# EAGLE design usb sniffer (EAGLE 6.5.0)
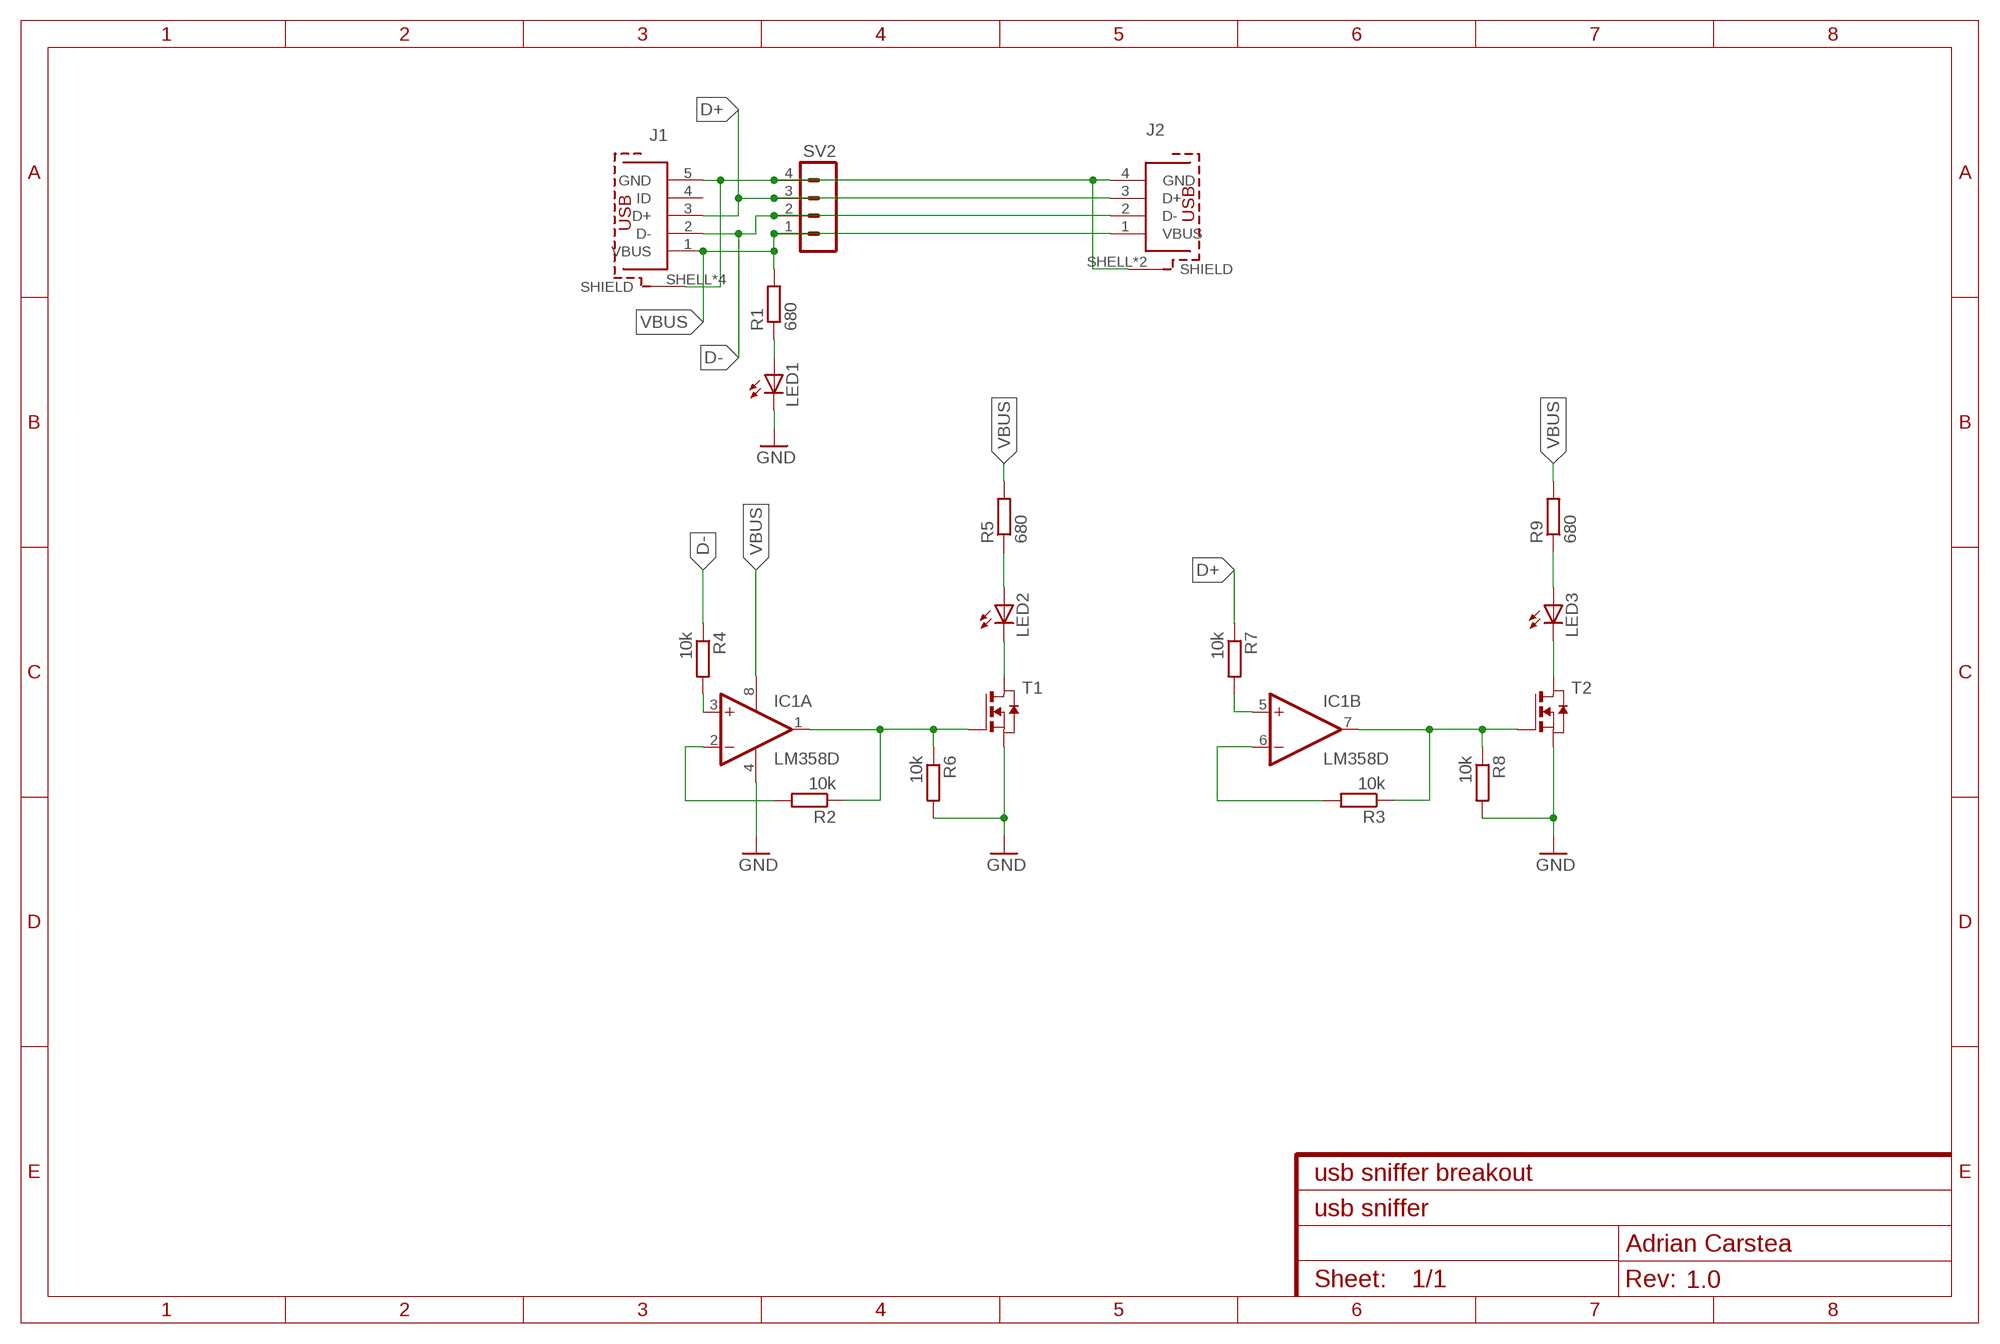
[diagram p0: schematic, sheet 1]
FRAME1 (FRAME-A4L): CNAME: usb sniffer breakout; CREVISION: 1.0; DESIGNER: Adrian Carstea

## Parts
IC1  LM358D  [SO08]
J1  629105136821  [629105136821]
J2  61400416021  [61400416021]
LED1  LEDSML0805  [SML0805]
LED2  LEDSML0805  [SML0805]
LED3  LEDSML0805  [SML0805]
R1  680  R-EU_R0805  [R0805]
R2  10k  R-EU_R0805  [R0805]
R3  10k  R-EU_R0805  [R0805]
R4  10k  R-EU_R0805  [R0805]
R5  680  R-EU_R0805  [R0805]
R6  10k  R-EU_R0805  [R0805]
R7  10k  R-EU_R0805  [R0805]
R8  10k  R-EU_R0805  [R0805]
R9  680  R-EU_R0805  [R0805]
SV2  MA04-1  [MA04-1]
T1  NMOSSOT23  [SOT-23]
T2  NMOSSOT23  [SOT-23]

## Nets
D+: J1.3(D+) J2.3(D+) R7.1 SV2.3
D-: J1.2(D-) J2.2(D-) R4.1 SV2.2
GND: IC1.4(P:V-) J1.5(GND) J1.SHELL1(SHIELD) J1.SHELL2(SHIELD) J1.SHELL3(SHIELD) J1.SHELL(SHIELD) J2.4(GND) J2.SHELL1(SHIELD) J2.SHELL(SHIELD) LED1.C R6.2 R8.2 SV2.4 T1.2(S) T2.2(S)
N$1: LED1.A R1.1
N$2: LED2.C T1.1(D)
N$3: IC1.2(A:-IN) R2.2
N$4: IC1.1(A:OUT) R2.1 R6.1 T1.3(G)
N$5: LED2.A R5.1
N$8: IC1.6(B:-IN) R3.2
N$17: IC1.7(B:OUT) R3.1 R8.1 T2.3(G)
N$18: IC1.3(A:+IN) R4.2
N$19: IC1.5(B:+IN) R7.2
N$21: LED3.C T2.1(D)
N$22: LED3.A R9.1
VBUS: IC1.8(P:V+) J1.1(VBUS) J2.1(VBUS) R1.2 R5.2 R9.2 SV2.1
Unconnected: J1.4(ID)

## Library data of the parts
IC1 = linear:LM358: OP AMP also LM158; LM258; LM2904 Source: http://cache.national.com/ds/LM/LM158.pdf
J1 = usb connector:629105136821: WR-COM SMT Horizontal 5 Contacts Micro USB Type B,5 pins=>Code : Con_I-O_COM_MicroUSB_629105136821 <http://katalog.we-online.de/media/images/eican/Con_I-O_COM_MicroUSB_629105136821_pf2.jpg> Details see: http://katalog.we-online.de/en/em/COM_MICRO_SMT_TYPE_B_HORIZONTAL/629105136821?m Created 2014-07-09, Karrer Zheng 2014 (C) Würth Elektronik
J2 = usb connector:61400416021: WR-COM Horizontal USB Type A=>Code :Con_I-O_COM_USB_2.0_A_61400416021 <http://katalog.we-online.de/media/images/eican/Con_I-O_COM_USB_2.0_A_61400416021_pf2.jpg> Details see: http://katalog.we-online.de/en/em/614_004_160_21 Created 2014-07-09, Karrer Zheng 2014 (C) Würth Elektronik
LED1-LED3 = led:LED: LED OSRAM: - CHIPLED LG R971, LG N971, LY N971, LG Q971, LY Q971, LO R971, LY R971 LH N974, LH R974 LS Q976, LO Q976, LY Q976 LO Q996 - Hyper CHIPLED LW Q18S LB Q993, LB Q99A, LB R99A - SideLED LS A670, LO A670, LY A670, LG A670, LP A670 LB A673, LV A673, LT A673, LW A673 LH A674 LY A675 LS A676, LA A676, LO A676, LY A676, LW A676 LS A679, LY A679, LG A679 - Hyper Micro SIDELED® LS Y876, LA Y876, LO Y876, LY Y876 LT Y87S - SmartLED LW L88C, LW L88S LB L89C, LB L89S, LG L890 LS L89K, LO L89K, LY L89K LS L896, LA L896, LO L896, LY L896 - TOPLED LS T670, LO T670, LY T670, LG T670, LP T670 LSG T670, LSP T670, LSY T670, LOP T670, LYG T670 LG T671, LOG T671, LSG T671 LB T673, LV T673, LT T673, LW T673 LH T674 LS T676, LA T676, LO T676, LY T676, LB T676, LH T676, LSB T676, LW T676 LB T67C, LV T67C, LT T67C, LS T67K, LO T67K, LY T67K, LW E67C LS E67B, LA E67B, LO E67B, LY E67B, LB E67C, LV E67C, LT E67C LW T67C LS T679, LY T679, LG T679 LS T770, LO T770, LY T770, LG T770, LP T770 LB T773, LV T773, LT T773, LW T773 LH T774 LS E675, LA E675, LY E675, LS T675 LS T776, LA T776, LO T776, LY T776, LB T776 LHGB T686 LT T68C, LB T68C - Hyper Mini TOPLED® LB M676 - Mini TOPLED Santana® LG M470 LS M47K, LO M47K, LY M47K Source: http://www.osram.convergy.de LUXEON: - LUMILED® LXK2-PW12-R00, LXK2-PW12-S00, LXK2-PW14-U00, LXK2-PW14-V00 LXK2-PM12-R00, LXK2-PM12-S00, LXK2-PM14-U00 LXK2-PE12-Q00, LXK2-PE12-R00, LXK2-PE12-S00, LXK2-PE14-T00, LXK2-PE14-U00 LXK2-PB12-K00, LXK2-PB12-L00, LXK2-PB12-M00, LXK2-PB14-N00, LXK2-PB14-P00, LXK2-PB14-Q00 LXK2-PR12-L00, LXK2-PR12-M00, LXK2-PR14-Q00, LXK2-PR14-R00 LXK2-PD12-Q00, LXK2-PD12-R00, LXK2-PD12-S00 LXK2-PH12-R00, LXK2-PH12-S00 LXK2-PL12-P00, LXK2-PL12-Q00, LXK2-PL12-R00 Source: www.luxeon.com KINGBRIGHT: KA-3528ASYC Source: www.kingbright.com
R1-R9 = resistor:R-EU_: RESISTOR, European symbol
SV2 = con-lstb:MA04-1: PIN HEADER; OC_FARNELL: unknown; OC_NEWARK: unknown
T1 T2 = zetex:NMOSSOT23: MOS FET; OC_FARNELL: unknown; OC_NEWARK: unknown

## Board
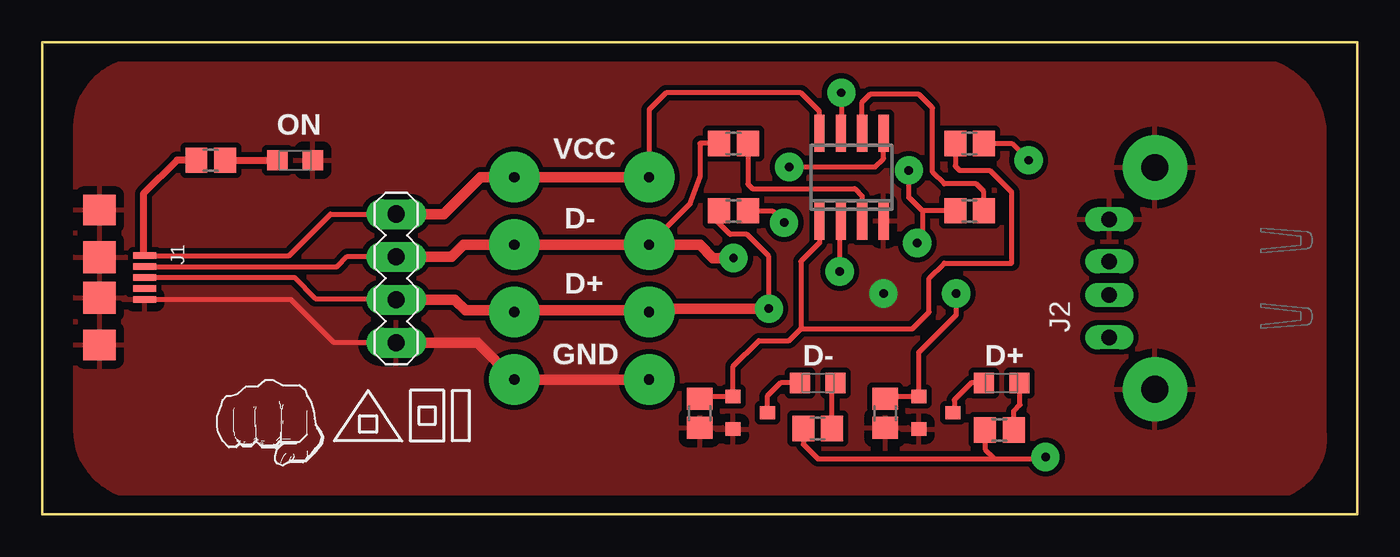
[diagram p1: board, top side]
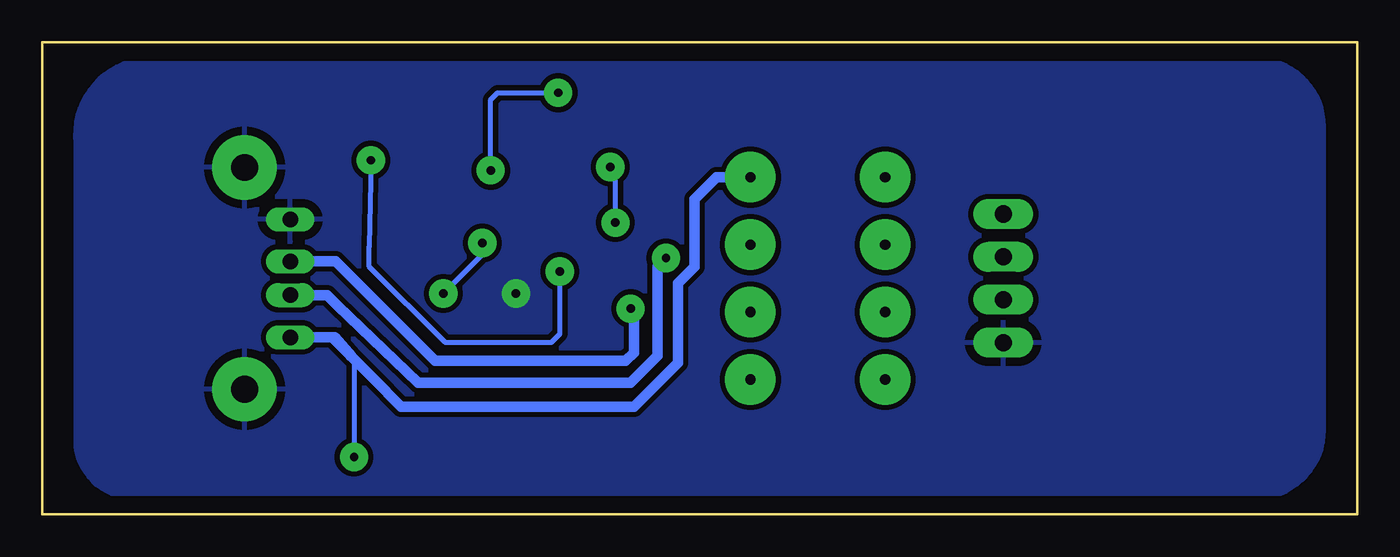
[diagram p2: board, bottom side, seen from below]

Size 78 x 28 mm. Coordinates in mm from the lower left corner, seen from the top.
Outline: 0,0 0,28 78,28 78,0 0,0
Copper layers (1*16): Top 0.035mm / dielectric 1.5mm / Bottom 0.035mm
Design rules "default *": minimum track width 10mil, minimum drill 24mil, track to track 8mil, track to pad 8mil, pad to pad 8mil, via to via 8mil, smd to smd 8mil, copper to edge 40mil, drill to drill 8mil, minimum pad ring 10mil, minimum via ring 8mil, stop-mask expansion 4mil, vias tented up to drill 0mil, thermal gap 0.5mm

### Footprints (pad centres in the part's own frame; a part is rotated, then mirrored left to right if it is on the bottom)
SO08 = smd 0.6 x 2.2: 1 -1.905,-2.6; 2 -0.635,-2.6; 3 0.635,-2.6; 4 1.905,-2.6; 5 1.905,2.6; 6 0.635,2.6; 7 -0.635,2.6; 8 -1.905,2.6
629105136821 = smd 0.4 x 1.35: 1 -1.3,2.675; 2 -0.65,2.675; 3 0,2.675; 4 0.65,2.675; 5 1.3,2.675 | smd 1.8 x 1.9: SHELL -4,0; SHELL3 4,0 | smd 1.9 x 1.9: SHELL1 -1.2,0; SHELL2 1.2,0
61400416021 = drill 0.92 long: 1 -3.5,2.71; 2 -1,2.71; 3 1,2.71; 4 3.5,2.71 | drill 1.6 pad 3.81: SHELL -6.57,0; SHELL1 6.57,0
SML0805 = smd 1.2 x 1.2: A 1.05,0; C -1.05,0
R0805 = smd 1.3 x 1.5: 1 -0.85,0; 2 0.85,0
MA04-1 = drill 1.016 pad 1.778 long: 1 -3.81,0; 2 -1.27,0; 3 1.27,0; 4 3.81,0
SOT-23 = smd 0.787 x 0.889: 1 0.025,-1.016; 2 -0.94,1.016; 3 0.991,1.016

### Placement (x,y rotation side)
IC1  48,20 0 top
J1  3.4,14.05 270 top
J2  66,14 90 top
LED1  15,21 180 top
LED2  46,7.8 0 top
LED3  56.9,7.8 0 top
R1  10,21 180 top
R2  55,22 0 top
R3  55,18 0 top
R4  41,22 0 top
R5  46,5.1 180 top
R6  39,6 270 top
R7  41,18 0 top
R8  50,6 270 top
R9  56.77,5.01 180 top
SV2  21,14 270 top
T1  42,6 90 top
T2  53,6 90 top
U$1  [ADILOGO]  18.06,4.36 0 top

### Tracks (layer width: path | path; a pad name or v marks a point on that pad's centre or on a via)
D+  (via drill 0.5 pad 1.68)
  Top 0.305: J1.3 14.95,14.05 16.2,12.8 20.93,12.8 SV2.3 | R7.1 40,17.85 40,17.4 40.8,16.6 41.8,16.6 43.1,15.3 v43.1,12.2
  Top 0.61: SV2.3 24.47,12.73 25.1,12.1 35.2,12.1 | 35.2,12.1 36,12.1 | v43.1,12.2 35.3,12.2 35.2,12.1
  Bottom 0.61: v43.1,12.2 42.9,12 42.9,9.6 43.4,9.1 54.7,9.1 60.6,15 J2.3
D-  (via drill 0.5 pad 1.68)
  Top 0.305: J1.2 17.5,14.7 18.1,15.3 20.97,15.3 SV2.2 | R4.1 39,22 39,20 38.43,18.42 38,18 36,16
  Top 0.61: SV2.2 24.27,15.27 25,16 36,16 39,16 39.8,15.2 v41,15.2
  Bottom 0.61: v41,15.2 41.5,14.7 41.5,9.4 43.1,7.8 55.7,7.8 60.52,12.4 61.1,13 J2.2
GND  (via drill 0.5 pad 1.68)
  Top 0.305: J1.5 14.75,12.75 17.3,10.2 SV2.4
  Top 0.61: SV2.4 25.81,10.19 28,8 36,8
  other vias: 49.9,13.1
  pour Top (isolate 0.305): 73,1 6,1 arc-90 2,5 2,23 arc-90 6,27 71,27 arc-90 76,23 76,5 arc-90
  pour Bottom (isolate 0.305): 72,1 6,1 arc-90 2,5 2,23 arc-90 6,27 72,27 arc-90 76,22 76,4 arc-90
N$1
  Top 0.406: R1.1 LED1.A
N$2
  Top 0.305: LED2.C 43.8,7.8 43,7 43,6.04 T1.1
N$3  (via drill 0.5 pad 1.68)
  Top 0.305: 47.4,17.36 IC1.2 47.3,17.34 v47.3,14.4 | R2.2 57.5,22 v58.5,21
  Bottom 0.305: v58.5,21 58.6,15.9 58.6,14.7 54.1,10.2 47.8,10.2 47.3,10.7 v47.3,14.4
N$4
  Top 0.305: R2.1 54.15,20.65 54.4,20.4 56.2,20.4 57.5,19.1 57.5,14.9 53.5,14.9 52.6,14 52.6,12 51.6,11 45,11 | IC1.1 46.1,16.1 45,15 45,11 | R6.1 39.14,6.99 T1.3 40.98,8.78 42.5,10.3 44.3,10.3 45,11
N$5
  Top 0.305: R5.1 46.85,7.6 LED2.A
N$8
  Top 0.305: R3.2 55.85,19.15 55.4,19.6 53.5,19.6 52.8,20.3 52.8,24.1 52,24.9 49.1,24.9 48.6,24.4 48.6,22.64 IC1.6
N$9  (via drill 0.6 pad 3)
  other vias: 28,20
N$10  (via drill 0.6 pad 3)
  other vias: 28,16
N$11  (via drill 0.6 pad 3)
  other vias: 28,12
N$12  (via drill 0.6 pad 3)
  other vias: 28,8
N$13  (via drill 0.6 pad 3)
  other vias: 36,8
N$14  (via drill 0.6 pad 3)
  other vias: 36,12
N$15  (via drill 0.6 pad 3)
  other vias: 36,16
N$16  (via drill 0.6 pad 3)
  other vias: 36,20
N$17  (via drill 0.5 pad 1.68)
  Top 0.305: R3.1 52.2,18 | 52.2,18 51.4,18.8 v51.4,20.4 | v47.4,25 47.4,22.64 IC1.7 | R8.1 50.14,6.99 T2.3 51.98,9.6 54.2,11.82 v54.2,13.1 | 52.2,18 52.2,16.4 v51.9,16.1
  Bottom 0.305: v51.4,20.4 51.4,24.6 51,25 v47.4,25 | v51.9,16.1 51.9,15.4 v54.2,13.1
N$18
  Top 0.305: R4.2 41.85,19.58 42.12,19.31 48.19,19.31 48.62,18.88 48.62,17.41 IC1.3
N$19  (via drill 0.5 pad 1.68)
  Top 0.305: R7.2 43.3,18 v44,17.3 | v44.3,20.6 49.4,20.6 49.9,21.1 IC1.5
  Bottom 0.305: v44,17.3 44,20.3 v44.3,20.6
N$21
  Top 0.305: LED3.C 55.1,7.8 54.1,6.8 54.1,6.11 T2.1
N$22
  Top 0.305: R9.1 57.62,6.12 58,6.5 58,7.75 LED3.A
VBUS  (via drill 0.5 pad 1.68, 0.6)
  Top 0.305: J1.1 14.65,15.35 17.1,17.8 SV2.1 | IC1.8 46.09,23.91 45,25 37,25 36,24 v36,20 | R9.2 55.92,3.88 56.5,3.3 | 56.5,3.3 59.4,3.3 v59.5,3.4 | R5.2 45.15,4.15 46,3.3 56.5,3.3
  Top 0.406: R1.2 8,21 6,19 6,15.43 J1.1
  Top 0.61: SV2.1 23.81,17.81 26,20 v36,20
  Bottom 0.305: 58.4,8.1 59.5,9 v59.5,3.4
  Bottom 0.61: v36,20 38,20 39.3,18.7 39.3,14.7 40.3,13.7 40.3,9 42.9,6.4 56.7,6.4 58.4,8.1 59.65,9.35 | 60.8,10.5 59.65,9.35 | J2.1 60.65,10.5 59.65,9.35

### Text on the board
tPlace: ON | VCC | D- | D+ | GND | D- | D+